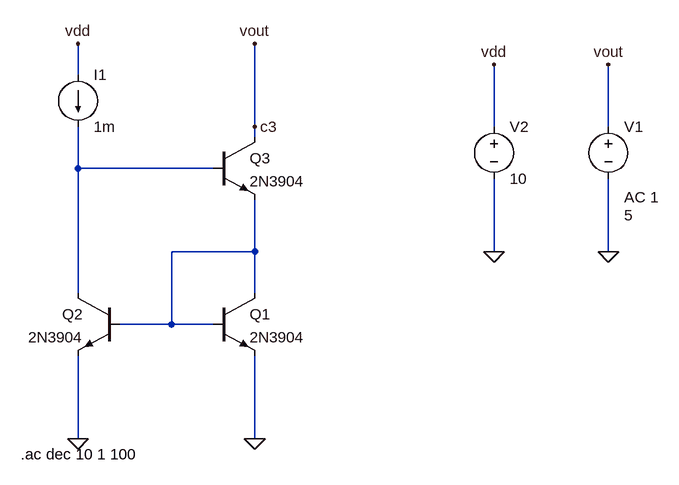
[diagram p0: schematic meros 1o (a).asc]
meros 1o (a).asc, the LTspice schematic file:
Version 4
SHEET 1 944 680
WIRE 0 16 0 -32
WIRE 272 96 272 -32
WIRE 640 96 640 0
WIRE 816 96 816 0
WIRE 272 112 272 96
WIRE 0 160 0 96
WIRE 208 160 0 160
WIRE 272 288 272 208
WIRE 272 288 144 288
WIRE 640 288 640 176
WIRE 816 288 816 176
WIRE 0 352 0 160
WIRE 272 352 272 288
WIRE 144 400 144 288
WIRE 144 400 64 400
WIRE 208 400 144 400
WIRE 0 576 0 448
WIRE 272 576 272 448
FLAG 272 -32 vout
FLAG 0 -32 vdd
FLAG 0 576 0
FLAG 272 576 0
FLAG 272 96 c3
FLAG 816 288 0
FLAG 816 0 vout
FLAG 640 288 0
FLAG 640 0 vdd
SYMBOL npn 208 112 R0
SYMATTR InstName Q3
SYMATTR Value 2N3904
SYMBOL npn 208 352 R0
SYMATTR InstName Q1
SYMATTR Value 2N3904
SYMBOL npn 64 352 M0
SYMATTR InstName Q2
SYMATTR Value 2N3904
SYMBOL current 0 16 R0
WINDOW 123 0 0 Left 0
WINDOW 39 0 0 Left 0
SYMATTR InstName I1
SYMATTR Value 1m
SYMBOL voltage 640 80 R0
WINDOW 123 0 0 Left 0
WINDOW 39 0 0 Left 0
SYMATTR InstName V2
SYMATTR Value 10
SYMBOL voltage 816 80 R0
WINDOW 3 24 152 Left 2
WINDOW 123 24 124 Left 2
WINDOW 39 0 0 Left 0
SYMATTR Value 5
SYMATTR Value2 AC 1
SYMATTR InstName V1
TEXT -88 600 Left 2 !.ac dec 10 1 100

The netlist it stands for:
* meros 1o (a).asc
Q3 c3 N001 N002 0 2N3904
Q1 N002 N002 0 0 2N3904
Q2 N001 N002 0 0 2N3904
I1 vdd N001 1m
V2 vdd 0 10
V1 c3 0 5 AC 1
.model NPN NPN
.model PNP PNP
.lib standard.bjt
.ac dec 10 1 100
.backanno
.end